# EAGLE schematic ESPrucherLoraScale7802 (EAGLE 9.5.2)
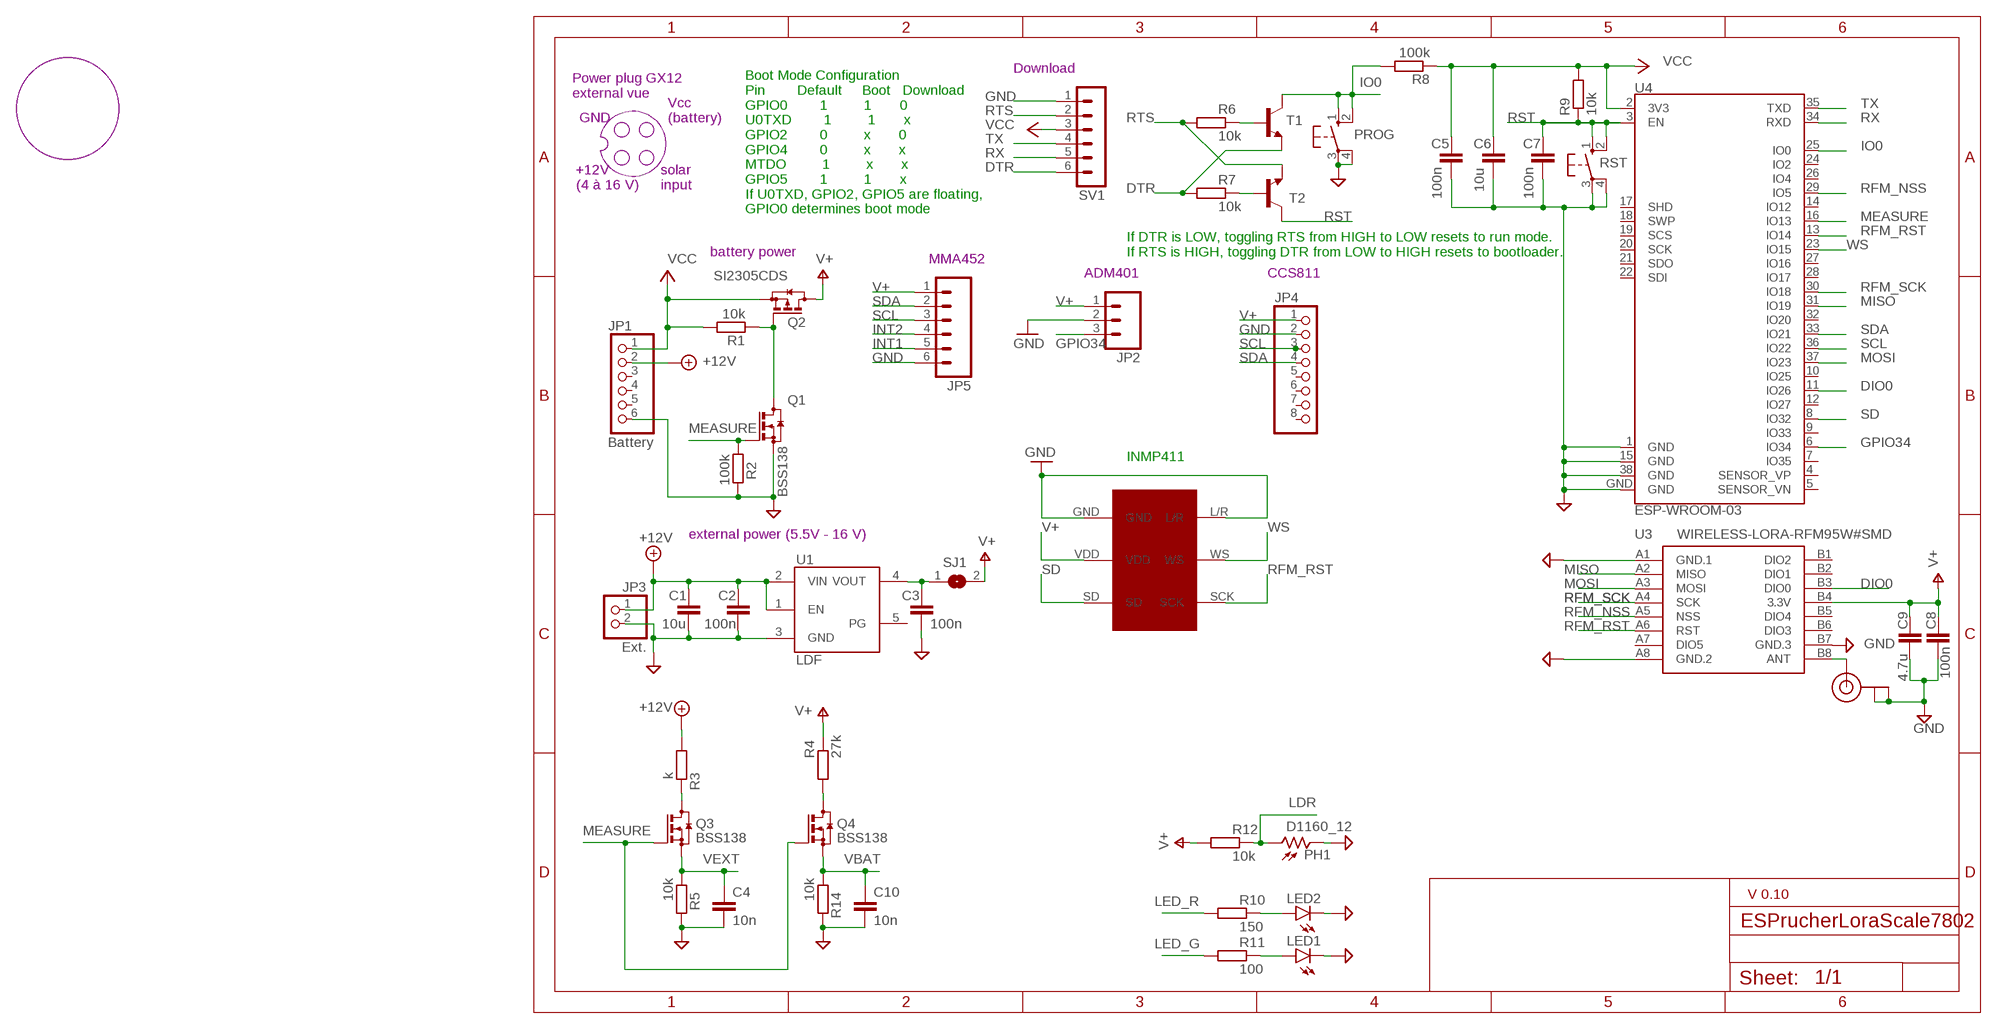
[diagram p0: schematic, sheet 1]

## Parts
C1  10u  CC1210  [C1210]
C2  100n  CC1206  [C1206]
C3  100n  CC1206  [C1206]
C4  10n  CC1206  [C1206]
C5  100n  CC1206  [C1206]
C6  10u  CC1210  [C1210]
C7  100n  CC1206  [C1206]
C8  100n  CC1206  [C1206]
C9  4.7u  CC1210  [C1210]
C10  10n  CC1206  [C1206]
J1  U.FL  [U.FL]
JP1  Battery  PINHD-1X6  [1X06]
JP2  M03PTH  [1X03]
JP3  Ext.  PINHD-1X2  [1X02]
JP4  HEADER-1X870MIL  [1X08_ROUND_70]
JP5  M06SIP  [1X06]
LED1  LEDCHIPLED_0805  [CHIPLED_0805]
LED2  LEDCHIPLED_0805  [CHIPLED_0805]
PH1  D1160_12  [D11XX]
PROG  10-XX  [B3F-10XX]
Q1  BSS138  [SOT23]
Q2  SI2305CDS  [SOT23]
Q3  BSS138  [SOT23]
Q4  BSS138  [SOT23]
R1  10k  RR1206  [R1206]
R2  100k  RR1206  [R1206]
R3  k  RR1206  [R1206]
R4  27k  RR1206  [R1206]
R5  10k  RR1206  [R1206]
R6  10k  RR1206  [R1206]
R7  10k  RR1206  [R1206]
R8  100k  RR1206  [R1206]
R9  10k  RR1206  [R1206]
R10  150  RR1206  [R1206]
R11  100  RR1206  [R1206]
R12  10k  RR1206  [R1206]
R14  10k  RR1206  [R1206]
RST  10-XX  [B3F-10XX]
SJ1  SJW  [SJW]
SV1  MA06-1  [MA06-1]
T1  MMBT2222ALT1-NPN-SOT23-BEC  [SOT23-BEC]
T2  MMBT2222ALT1-NPN-SOT23-BEC  [SOT23-BEC]
U1  LDF3.3  [PPAK]
U3  WIRELESS-LORA-RFM95W#SMD  [WIRELESS-LORA-RFM95W#SMD]
U4  ESP-WROOM-03  [ESP-WROOM-03]
U$1  INMP411  [INMP411FOOTPRINT]

## Nets
+12V: C1.1 C2.1 JP1.2 JP3.1 R3.1 U1.1(EN) U1.2(VIN)
DIO0: U3.B3(DIO0) U4.11(IO26)
DTR: R7.1 SV1.6 T1.E
GND: C1.2 C2.2 C3.2 C4.2 C5.2 C6.2 C7.2 C8.2 C9.2 C10.2 J1.1(GND) J1.2(GND) JP1.6 JP2.2 JP3.2 JP4.2 JP5.6 LED1.C LED2.C PH1.2 PROG.3(P) PROG.4(P1) Q1.2(S) R2.2 R5.2 R14.2 RST.3(P) RST.4(P1) SV1.1 U1.3(GND) U3.A1(GND.1) U3.A8(GND.2) U3.B7(GND.3) U4.1(GND) U4.15(GND) U4.38(GND) U4.GND U$1.GND U$1.L/R
GPIO34: JP2.3 U4.6(IO34)
INT1: JP5.5
INT2: JP5.4
IO0: PROG.1(S) PROG.2(S1) R8.2 T1.C U4.25(IO0)
LDR: PH1.1 R12.2
LED_G: R11.1
LED_R: R10.1
MEASURE: Q1.1(G) Q3.1(G) Q4.1(G) R2.1 U4.16(IO13)
MISO: U3.A2(MISO) U4.31(IO19)
MOSI: U3.A3(MOSI) U4.37(IO23)
N$1: Q1.3(D) Q2.1(G) R1.1
N$2: Q4.3(D) R4.1
N$3: J1.3(SIGNAL) U3.B8(ANT)
N$4: C3.1 SJ1.1 U1.4(VOUT)
N$5: Q3.3(D) R3.2
N$7: LED2.A R10.2
N$8: LED1.A R11.2
N$10: R6.2 T1.B
N$14: R7.2 T2.B
RFM_NSS: U3.A5(NSS) U4.29(IO5)
RFM_RST: U3.A6(RST) U4.13(IO14) U$1.SCK
RFM_SCK: U3.A4(SCK) U4.30(IO18)
RST: C7.1 R9.1 RST.1(S) RST.2(S1) T2.C U4.3(EN)
RTS: R6.1 SV1.2 T2.E
RX: SV1.5 U4.34(RXD)
SCL: JP4.3 JP5.3 U4.36(IO22)
SD: U4.8(IO32) U$1.SD
SDA: JP4.4 JP5.2 U4.33(IO21)
TX: SV1.4 U4.35(TXD)
V+: C8.1 C9.1 JP2.1 JP4.1 JP5.1 Q2.3(D) R4.2 R12.1 SJ1.2 U3.B4(3.3V) U$1.VDD
VBAT: C10.1 Q4.2(S) R14.1
VCC: C5.1 C6.1 JP1.1 Q2.2(S) R1.2 R8.1 R9.2 SV1.3 U4.2(3V3)
VEXT: C4.1 Q3.2(S) R5.1
WS: U4.23(IO15) U$1.WS
Unconnected: JP1.3 JP1.4 JP1.5 JP4.5 JP4.6 JP4.7 JP4.8 U1.5(PG) U3.A7(DIO5) U3.B1(DIO2) U3.B2(DIO1) U3.B5(DIO4) U3.B6(DIO3) U4.4(SENSOR_VP) U4.5(SENSOR_VN) U4.7(IO35) U4.9(IO33) U4.10(IO25) U4.12(IO27) U4.14(IO12) U4.17(SHD) U4.18(SWP) U4.19(SCS) U4.20(SCK) U4.21(SDO) U4.22(SDI) U4.24(IO2) U4.26(IO4) U4.27(IO16) U4.28(IO17) U4.32(IO20)

## Notes on the sheet
- Download
- Power plug GX12
  external vue
- GND
- Vcc
  (battery)
- +12V
  (4 à 16 V)
- solar 
  input
- Boot Mode Configuration
  Pin        Default     Boot   Download
  GPIO0        1         1       0
  U0TXD        1         1       x
  GPIO2        0         x       0
  GPIO4        0         x       x
  MTDO         1         x       x
  GPIO5        1         1       x
  If U0TXD, GPIO2, GPIO5 are floating, 
  GPIO0 determines boot mode
- battery power
- If DTR is LOW, toggling RTS from HIGH to LOW resets to run mode.
  If RTS is HIGH, toggling DTR from LOW to HIGH resets to bootloader.
- MMA452
- ADM401 | CCS811
- INMP411
- external power (5.5V - 16 V)
- V 0.10

## Library data of the parts
C1-C10 = eagle-ltspice:C: CAPACITOR, European symbol; SPICEMODEL: NONE; SPICEPREFIX: C
J1 = microbuilder:U.FL: U.FL Antenna Connector
JP1 = pinhead:PINHD-1X6: PIN HEADER
JP2 = SparkFun:M03: Header 3 Standard 3-pin 0.1" header. Use with straight break away headers (SKU : PRT-00116), right angle break away headers (PRT-00553), swiss pins (PRT-00743), machine pins (PRT-00117), and female headers (PRT-00115). Molex polarized connector foot print use with SKU : PRT-08232 with associated crimp pins and housings.
JP3 = pinhead:PINHD-1X2: PIN HEADER
JP4 = microbuilder:HEADER-1X8: PIN HEADER
JP5 = SparkFun:M06: Header 6 Standard 6-pin 0.1" header. Use with straight break away headers (SKU : PRT-00116), right angle break away headers (PRT-00553), swiss pins (PRT-00743), machine pins (PRT-00117), and female headers (PRT-00115). Molex polarized connector foot print use with SKU : PRT-08094 with associated crimp pins and housings. NOTES ON THE VARIANTS LOCK and LOCK_LONGPADS... This footprint was designed to help hold the alignment of a through-hole component (i.e. 6-pin header) while soldering it into place. You may notice that each hole has been shifted either up or down by 0.005 of an inch from it's more standard position (which is a perfectly straight line). This slight alteration caused the pins (the squares in the middle) to touch the edges of the holes. Because they are alternating, it causes a "brace" to hold the component in place. 0.005 has proven to be the perfect amount of "off-center" position when using our standard breakaway headers. Although looks a little odd when you look at the bare footprint, once you have a header in there, the alteration is very hard to notice. Also, if you push a header all the way into place, it is covered up entirely on the bottom side. This idea of altering the position of holes to aid alignment will be further integrated into the Sparkfun Library for other footprints. It can help hold any component with 3 or more connection pins.
LED1 LED2 = led:LED: LED OSRAM: - CHIPLED LG R971, LG N971, LY N971, LG Q971, LY Q971, LO R971, LY R971 LH N974, LH R974 LS Q976, LO Q976, LY Q976 LO Q996 - Hyper CHIPLED LW Q18S LB Q993, LB Q99A, LB R99A - SideLED LS A670, LO A670, LY A670, LG A670, LP A670 LB A673, LV A673, LT A673, LW A673 LH A674 LY A675 LS A676, LA A676, LO A676, LY A676, LW A676 LS A679, LY A679, LG A679 - Hyper Micro SIDELED® LS Y876, LA Y876, LO Y876, LY Y876 LT Y87S - SmartLED LW L88C, LW L88S LB L89C, LB L89S, LG L890 LS L89K, LO L89K, LY L89K LS L896, LA L896, LO L896, LY L896 - TOPLED LS T670, LO T670, LY T670, LG T670, LP T670 LSG T670, LSP T670, LSY T670, LOP T670, LYG T670 LG T671, LOG T671, LSG T671 LB T673, LV T673, LT T673, LW T673 LH T674 LS T676, LA T676, LO T676, LY T676, LB T676, LH T676, LSB T676, LW T676 LB T67C, LV T67C, LT T67C, LS T67K, LO T67K, LY T67K, LW E67C LS E67B, LA E67B, LO E67B, LY E67B, LB E67C, LV E67C, LT E67C LW T67C LS T679, LY T679, LG T679 LS T770, LO T770, LY T770, LG T770, LP T770 LB T773, LV T773, LT T773, LW T773 LH T774 LS E675, LA E675, LY E675, LS T675 LS T776, LA T776, LO T776, LY T776, LB T776 LHGB T686 LT T68C, LB T68C - Hyper Mini TOPLED® LB M676 - Mini TOPLED Santana® LG M470 LS M47K, LO M47K, LY M47K Source: http://www.osram.convergy.de LUXEON: - LUMILED® LXK2-PW12-R00, LXK2-PW12-S00, LXK2-PW14-U00, LXK2-PW14-V00 LXK2-PM12-R00, LXK2-PM12-S00, LXK2-PM14-U00 LXK2-PE12-Q00, LXK2-PE12-R00, LXK2-PE12-S00, LXK2-PE14-T00, LXK2-PE14-U00 LXK2-PB12-K00, LXK2-PB12-L00, LXK2-PB12-M00, LXK2-PB14-N00, LXK2-PB14-P00, LXK2-PB14-Q00 LXK2-PR12-L00, LXK2-PR12-M00, LXK2-PR14-Q00, LXK2-PR14-R00 LXK2-PD12-Q00, LXK2-PD12-R00, LXK2-PD12-S00 LXK2-PH12-R00, LXK2-PH12-S00 LXK2-PL12-P00, LXK2-PL12-Q00, LXK2-PL12-R00 Source: www.luxeon.com KINGBRIGHT: KA-3528ASYC Source: www.kingbright.com
PH1 = photo-elements:D11: Photo Sensor Oil Burner Control Applications Source: http://optoelectronics.perkinelmer.com/content/Datasheets/DTS_PhotocellsD1160.pdf
PROG RST = switch-omron:10-XX: OMRON SWITCH; MPN: B3F-1000; OC_FARNELL: 176432; OC_NEWARK: 36M3542
Q1 Q3 Q4 = detect:BSS138: N-CHANNEL MOS FET
Q2 = transistor-small-signal-perso:SI2305CDS: P-CHANNEL MOS FET
R1-R12 R14 = eagle-ltspice:R: RESISTOR, European symbol; SPICEMODEL: NONE; SPICEPREFIX: R
SJ1 = jumper:SJ: SMD solder JUMPER
SV1 = con-lstb:MA06-1: PIN HEADER; OC_FARNELL: unknown; OC_NEWARK: unknown
T1 T2 = transistor:*-NPN-: NPN Transistror BF959 corrected 2008.03.06
U1 = LDO:LDF: LDFxx 1 A very low drop voltage regulator
U3 = diy-modules:WIRELESS-LORA-RFM95W: 868/915 MHz LoRa Radio Transceiver Module based on SX1276 chip Click here to find device on ebay.com <http://www.ebay.com/sch/RFM95W+transceiver>
U4 = esp32-sparkfun (1):ESP-WROOM-03; OC_FARNELL: unknown
U$1 = my_library_eagle:INMP411: Micro